# EAGLE schematic LED Board V2 (EAGLE 7.5.0)
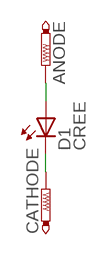
[diagram p0: schematic, sheet 1]

## Parts
ANODE  PTR1PAD1-20  [P1-20]
CATHODE  PTR1PAD1-20  [P1-20]
D1  CREE  [CREE-XLAMP-XM-L]

## Nets
ANODE: ANODE.TP D1.A D1.A@1(A)
CATHODE: CATHODE.TP D1.C D1.C1(C) D1.C@1(C)

## Library data of the parts
ANODE CATHODE = testpad:PTR1: TEST PIN
D1 = 2015_LED_Driver:CREE: Cree XBD model LED's digikey # XBDAWT-00-0000-000000F51CT-ND